# Altium schematic sheet whte_noise.SchDoc
size A4
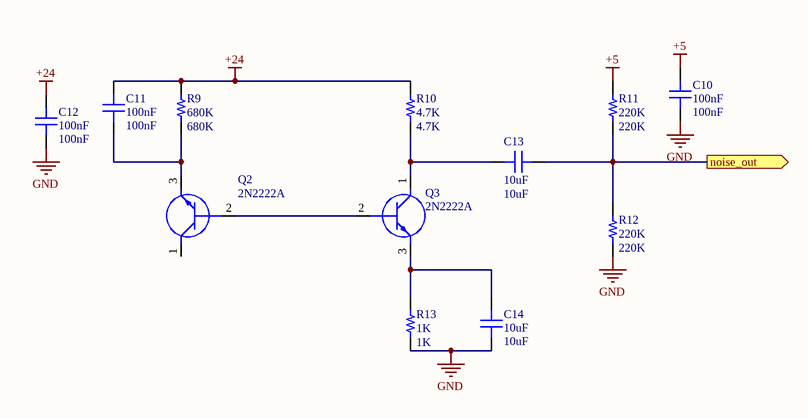
[diagram p0: whte_noise.SchDoc]

## Parts
C10  100nF  [cap805]
C11  100nF  [cap805]
C12  100nF  [cap805]
C13  10uF  [cap805]
C14  10uF  [cap805]
Q2  2N2222A  [soT95p280x130-3n]
Q3  2N2222A  [soT95p280x130-3n]
R9  680K  [0603R]
R10  4.7K  [0603R]
R11  220K  [0603R]
R12  220K  [0603R]
R13  1K  [0603R]

## Ports
noise_out (out)

## Nets
+5: C10.1 R11.2
+24: C11.2 C12.1 R9.2 R10.2
GND: C10.2 C12.2 C14.1 R12.1 R13.1
noise_out: C13.1 R11.1 R12.2 ; port noise_out
NetC11_1: C11.1 Q2.3(E) R9.1
NetC13_2: C13.2 Q3.1(C) R10.1
NetC14_2: C14.2 Q3.3(E) R13.2
NetQ2_2: Q2.2(B) Q3.2(B)

Not connected (* = marked no-connect by the designer): Q2 1(C)

## Library data of the parts
C10-C14 = Capacitor: CAP SMD 0805; Part Number: C0805X106K9RAC7800
  C10-C12: Value: 100nF
  C13 C14: Value: 10uF
Q2 Q3 = 2N2222A: Transistor BJT NPN SMD; pin to pad: 1>3 2>1 3>2; Manufacturer_Name: Foshan Blue Rocket Elec; Datasheet Link: https://datasheet.lcsc.com/szlcsc/1901291437_Foshan-Blue-Rocket-Elec-2N2222A_C358533.pdf; Height: 4.7mm; Manufacturer_Part_Number: 2N2222A
R9-R13 = Resistor: RES SMD 0603; Part Number: RCS0805100KFKEA
  R9: Value: 680K
  R10: Value: 4.7K
  R11 R12: Value: 220K
  R13: Value: 1K